# EAGLE schematic Acc+Comp+Gyro (EAGLE 7.2.0)
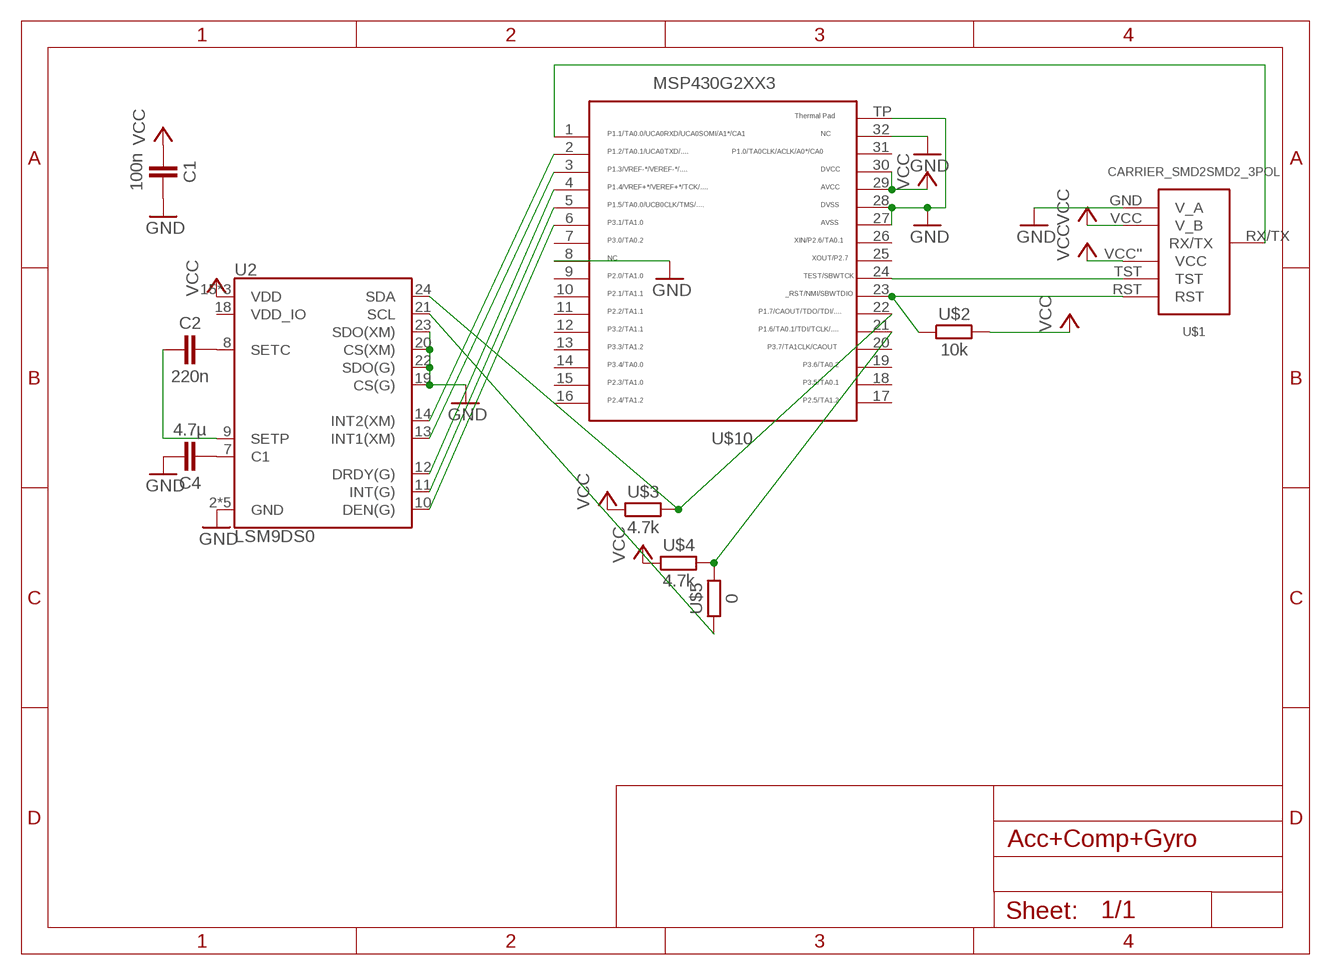
[diagram p0: schematic, sheet 1]

## Parts
C1  100n  CAPACITOR  [603]
C2  220n  CAPACITOR  [603]
C4  4.7µ  CAPACITOR  [603]
U2  LSM9DS0  [LGA-24]
U$1  CARRIER_SMD2SMD2_3POL  [CARRIER_SMD2_3POL]
U$2  10k  RESISTOR0603  [603]
U$3  4.7k  RESISTOR0603  [603]
U$4  4.7k  RESISTOR0603  [603]
U$5  0  RESISTOR0603  [603]
U$10  MSP430G2553  [QFN32]

## Nets
GND: C1.2 C4.2 U2.2(GND) U2.3(GND) U2.4(GND) U2.5(GND) U2.6(GND) U2.19(CS(G)) U2.20(CS(XM)) U2.22(SDO(G)) U2.23(SDO(XM)) U$1.GND(V_A) U$10.8 U$10.27 U$10.28 U$10.32 U$10.TP
N$2: U2.24(SDA) U$3.2 U$10.22
N$3: U$1.TST U$10.24
N$4: U$1.RST U$2.1 U$10.23
N$5: U$4.2 U$5.2 U$10.21
N$6: C4.1 U2.7(C1)
N$7: C2.2 U2.8(SETC)
N$11: C2.1 U2.9(SETP)
N$12: U$1.RX/TX U$10.1
N$13: U2.14(INT2(XM)) U$10.2
N$14: U2.13(INT1(XM)) U$10.3
N$16: U2.12(DRDY(G)) U$10.4
N$17: U2.11(INT(G)) U$10.5
N$18: U2.10(DEN(G)) U$10.6
N$19: U2.21(SCL) U$5.1
VCC: C1.1 U2.15(VDD) U2.16(VDD) U2.17(VDD) U$1.VCC''(VCC) U$1.VCC(V_B) U$2.2 U$3.1 U$4.1 U$10.29 U$10.30
Unconnected: U2.18(VDD_IO) U$10.7 U$10.9 U$10.10 U$10.11 U$10.12 U$10.13 U$10.14 U$10.15 U$10.16 U$10.17 U$10.18 U$10.19 U$10.20 U$10.25 U$10.26 U$10.31

## Library data of the parts
C1 C2 C4 = thar:CAPACITOR
U2 = SparkFun-DigitalIC:LSM9DS0: LSM9DS0 3D Accelerometer, 3D Gyroscope, 3D Magnetomter Features: 3 acceleration channels, 3 angular rate channels, 3 magnetic field channels ±2/±4/±6/±8/±16 g linear acceleration full scale ±2/±4/±8/±12 gauss magnetic full scale ±245/±500/±2000 dps angular rate full scale 16-bit data output SPI / I2C serial interfaces Analog supply voltage 2.4 V to 3.6 V Power-down mode / low-power mode Programmable interrupt generators Embedded self-test Embedded temperature sensor Embedded FIFO Position and motion detection functions Click/double-click recognition
U$1 = thar:CARRIER_SMD2
U$2-U$5 = thar:RESISTOR
U$10 = thar:MSP430G2553: TEXAS INSTRUMENTS MSP430G2553IRHB32R MCU, 16BIT, MSP430, 16MHZ, QFN-32 Farnell Best.Nr.: 2325726 Herst.Bez.: MSP430G2553IRHB32R